# Altium schematic sheet Esquemático.SchDoc
size A4; SheetNumber: 1; SheetTotal: 1
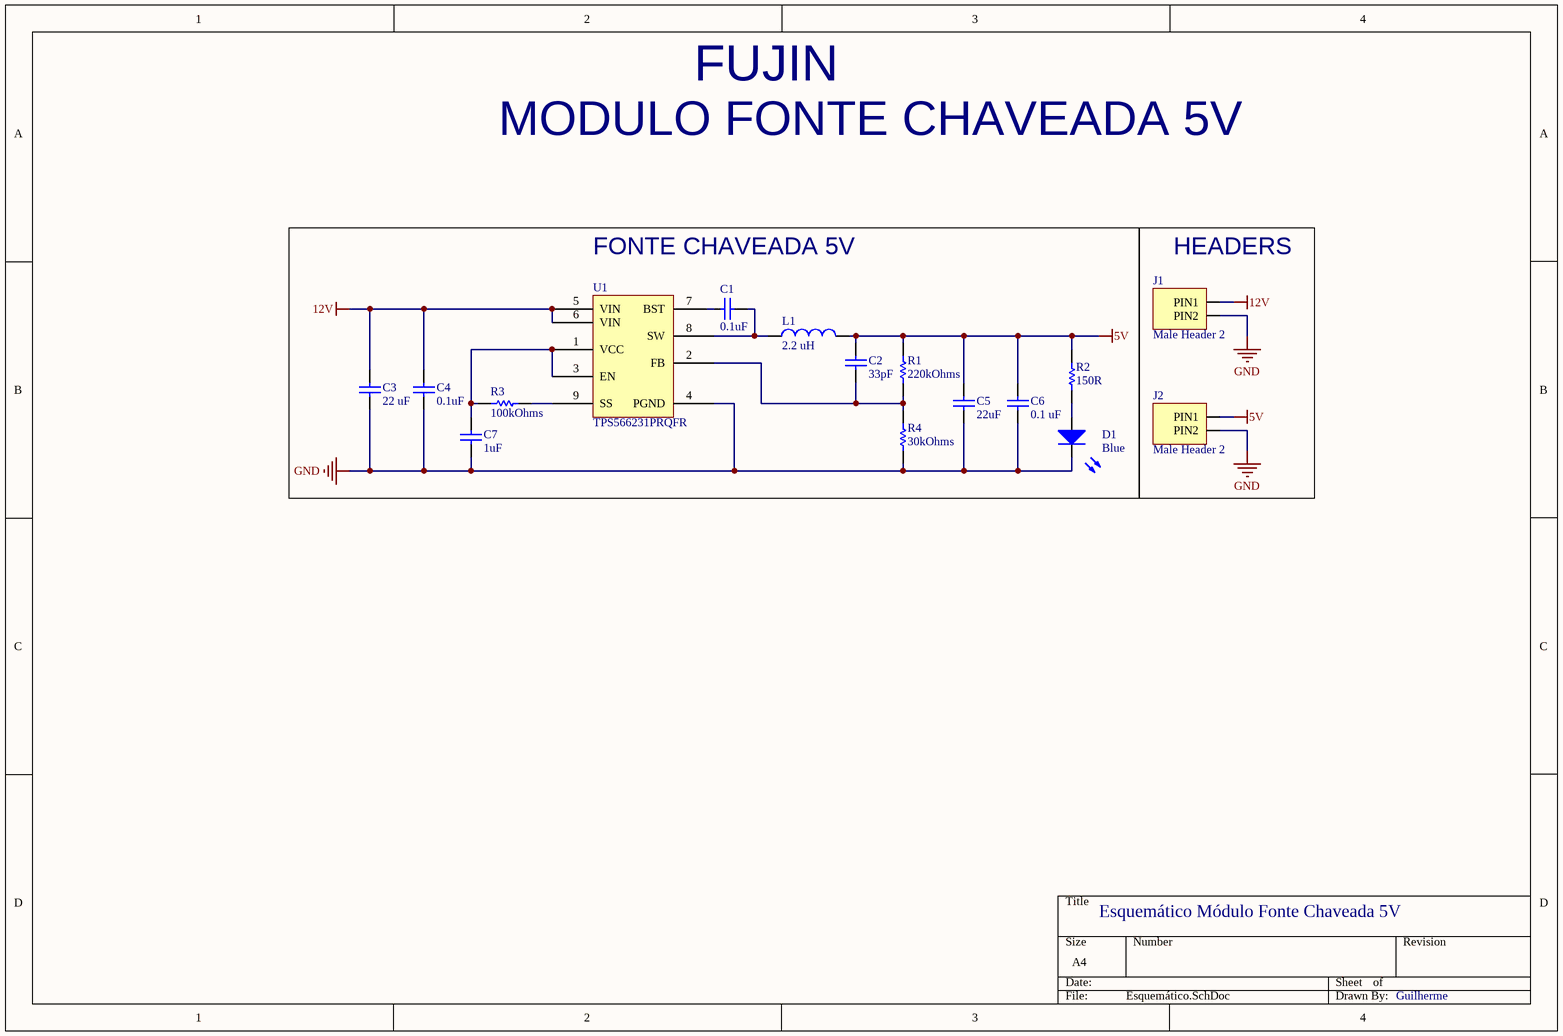
[diagram p0: Esquemático.SchDoc]

## Parts
C1  0.1uF  [CAPC1005X55N]
C2  33pF  [C0201]
C3  22 uF  [C0805]
C4  0.1uF  [CAPC1608X90N]
C5  22uF  [C0805]
C6  0.1 uF  [C0603]
C7  1uF  [C1005]
D1  Blue  [DIODO_2-SMD-3215]
J1  Male Header 2  [MALE HEADER 2]
J2  Male Header 2  [MALE HEADER 2]
L1  2.2 uH  [6045]
R1  220kOhms  [RESISTOR_0603]
R2  150R  [RESISTOR_0402]
R3  100kOhms  [RESC1005X40N]
R4  30kOhms  [RESC1608X55N]
U1  TPS566231PRQFR  [RQF0009A]

## Blocks framed on the sheet
FONTE CHAVEADA 5V: C1-C7 D1 L1 R1-R4 U1
HEADERS: J1 J2

## Nets
5V: C2.2 C5.2 C6.2 J2.PIN1 L1.2 R1.2 R2.2
12V: C3.2 C4.2 J1.PIN1 U1.5(VIN) U1.6(VIN)
GND: C3.1 C4.1 C5.1 C6.1 C7.1 D1.C J1.PIN2 J2.PIN2 R4.1 U1.4(PGND)
NetC1_1: C1.1 L1.1 U1.8(SW)
NetC1_2: C1.2 U1.7(BST)
NetC2_1: C2.1 R1.1 R4.2 U1.2(FB)
NetC7_2: C7.2 R3.1 U1.1(VCC) U1.3(EN)
NetD1_A: D1.A R2.1
NetR3_2: R3.2 U1.9(SS)

## Notes on the sheet
- FUJIN
- MODULO FONTE CHAVEADA 5V
- Esquemático Módulo Fonte Chaveada 5V
- Guilherme

## Library data of the parts
C1 = GRM155R61C104KA88D: CAP CER 0.1uF 16V X5R 0402; Manufacturer: Murata; Tolerance: 10%; Library Control - Checked Footprint: Yes; Library Control - Person that Checked Footprint: Guilherme; Supplier 1: Mouser; Part Number: GRM155R61C104KA88D; Category: Ceramic Capacitors; Price: 1 = 0,10, 10=0,024, 100=0,011 (USD); Supplier Part Number 1: 81-GRM155R61C104KA8D; Library Ref: Capacitor; Operating Temperature: -55°C ~ 85°C; Package / Case: 0402 (1005 Metric); Size / Dimension: 1,0 L x 0,5 W x 0,5 H; Value: 0.1uF; Voltage - Rated: 16V; ESR: -; Dieletric: X5R; Library Control - Checked Schematic: Yes; Library Control - Last Update: 24/07/2021 11:05; Library Control - Person that Checked Schematic: Guilherme; Library Control - Person that did the Last Update Footprint: Guilherme; Library Control - Person that did the Last Update Schematic: Guilherme; ComponentLink1Description: Datasheet; ComponentLink1URL: https://br.mouser.com/datasheet/2/281/1/GRM155R61C104KA88_01A-1983743.pdf; ComponentLink2Description: Mouser Link; ComponentLink2URL: https://br.mouser.com/ProductDetail/Murata-Electronics/GRM155R61C104KA88D?qs=%2Fha2pyFadugsr51Fgcs3VGJIvx6dQb2fpcJyrxDKYTBEoW5q5paGTQ%3D%3D
C2 = CGA1A2C0G1E330J030BA: CAP CER 33pF 25V C0G (NP0) 0201; Manufacturer: TDK; Tolerance: 5%; Library Control - Checked Footprint: Yes; Library Control - Person that Checked Footprint: Guilherme; Library Control - Person that did the Last Update Footprint: Stéfany (Ster); Supplier 1: Mouser; Part Number: CGA1A2C0G1E330J030BA; Category: Ceramic Capacitors; Price: 1 = 0,34, 10=0,082, 100=0,036 (USD); Supplier Part Number 1: 810-CGA1A2C0G1E330J; Library Ref: Capacitor; Operating Temperature: -55°C ~ 125°C; Package / Case: 0201 (0603 Metric); Size / Dimension: 0,6 L x 0,3 W x 0,3 H; Value: 33pF; Voltage - Rated: 25V; ESR: -; Dieletric: C0G (NP0); Library Control - Checked Schematic: Yes; Library Control - Last Update: 06/09/2021 22:37; Library Control - Person that Checked Schematic: Guilherme; Library Control - Person that did the Last Update Schematic: Guilherme; ComponentLink1Description: Datasheet; ComponentLink1URL: https://product.tdk.com/system/files/dam/doc/product/capacitor/ceramic/mlcc/catalog/mlcc_automotive_general_en.pdf; ComponentLink2Description: Mouser Link; ComponentLink2URL: https://br.mouser.com/ProductDetail/TDK/CGA1A2C0G1E330J030BA?qs=%2Fha2pyFadujYI3MxcM4e87jCoYqxM0hkLZT6GI2mHBlvDM1kNVjG3riGd7BUgX8y
C3 = C2012X5R1V226M125AC: CAP CER 22UF 35V X7R 0805; Manufacturer: TDK; Tolerance: 20%; Dieletric: X5R; Library Control - Person that did the Last Update Footprint: Pierre; Supplier 1: Mouser; Part Number: C2012X5R1V226M125AC; Category: Ceramic Capacitor; Price: 1= 0,99, 10= 0,751, 100= 0,537 (USD); Supplier Part Number 1: 810-C2012X5R1V226MAC; Library Ref: Capacitor; Operating Temperature: -55C ~ +85C; Package / Case: 0805 (2012 metric); Size / Dimension: 1.25mm x 2mm x 1.25 mm (HxLxW); Value: 22 uF; Voltage - Rated: 35V; ESR: -; Library Control - Last Update: 11/07/21 - 12:10; Library Control - Person that did the Last Update Schematic: Pierre; ComponentLink1Description: Mouser Link; ComponentLink1URL: https://br.mouser.com/ProductDetail/TDK/C2012X5R1V226M125AC?qs=%2Fha2pyFadujDqt6GaOhNLRdQFkZZGmK3Zr0qXWQTG43%252BZCfduHGyTu2Pm2ksWbbx; ComponentLink2Description: Datasheet; ComponentLink2URL: https://product.tdk.com/system/files/dam/doc/product/capacitor/ceramic/mlcc/catalog/mlcc_commercial_general_en.pdf
C4 = GRM188R72A104KA35D: CAP CER 0.1uF 100V X7R 0603; Manufacturer: Murata; Tolerance: 10%; Library Control - Checked Footprint: Yes; Library Control - Person that Checked Footprint: Guilherme; Supplier 1: Mouser; Part Number: GRM188R72A104KA35D; Category: Ceramic Capacitors; Price: 1 = 0,28, 10=0,121, 100=0,102 (USD); Supplier Part Number 1: 81-GRM188R72A104KA35; Library Ref: Capacitor; Operating Temperature: -55°C ~ 125°C; Package / Case: 0603 (1608 Metric); Size / Dimension: 1,60 L x 0,80 W x 0,80 H; Value: 0.1uF; Voltage - Rated: 100V; ESR: -; Dieletric: X7R; Library Control - Checked Schematic: Yes; Library Control - Last Update: 24/07/2021 11:05; Library Control - Person that Checked Schematic: Guilherme; Library Control - Person that did the Last Update Footprint: Guilherme; Library Control - Person that did the Last Update Schematic: Guilherme; ComponentLink1Description: Datasheet; ComponentLink1URL: https://br.mouser.com/datasheet/2/281/1/GRM188R72A104KA35_01A-1985906.pdf; ComponentLink2Description: Mouser Link; ComponentLink2URL: https://br.mouser.com/ProductDetail/Murata-Electronics/GRM188R72A104KA35D?qs=%2Fha2pyFadujAJDtX6qcn4LVf2TIEcBlj4PhfxwA4tsZBUcArwGh4MA%3D%3D
C5 = LMK212BJ226MG-T: CAP CER 22uF 10V X5R 0805; Manufacturer: Taiyo Yuden; Tolerance: 20%; Library Control - Checked Footprint: Yes; Library Control - Person that Checked Footprint: Guilherme; Library Control - Person that did the Last Update Footprint: Stéfany (Ster); Supplier 1: Mouser; Part Number: LMK212BJ226MG-T; Category: Ceramic Capacitors; Price: 1 = 0,40, 10=0,283, 100=0,17 (USD); Supplier Part Number 1: 963-LMK212BJ226MG-T; Library Ref: Capacitor; Operating Temperature: -55°C ~ 85°C; Package / Case: 0805 (2012 Metric); Size / Dimension: 2,0 L x 1,25 W x 1,25 H; Value: 22uF; Voltage - Rated: 10V; ESR: -; Dieletric: X5R; Library Control - Checked Schematic: Yes; Library Control - Last Update: 06/09/2021 23:23; Library Control - Person that Checked Schematic: Guilherme; Library Control - Person that did the Last Update Schematic: Guilherme; ComponentLink1Description: Datasheet; ComponentLink1URL: https://br.mouser.com/datasheet/2/396/mlcc02_e-1307760.pdf; ComponentLink2Description: Mouser Link; ComponentLink2URL: https://br.mouser.com/ProductDetail/Taiyo-Yuden/LMK212BJ226MG-T?qs=%2Fha2pyFaduhTWJqyA9yCTREf%2Fo8XKOh0QNvJbjdkP7PnwxAMlkivcQ%3D%3D
C6 = GRM188R71E104KA01D: CAP CER 0.1uF 25V X7R 0603; Manufacturer: Murata Electronics; Tolerance: 10%; Voltage - Rated: 25 VDC; ESR: 100 mΩ; Library Control - Checked Footprint: Yes; Library Control - Person that Checked Footprint: Nikaum; Library Control - Person that did the Last Update Footprint: Raquel; Supplier 1: Mouser; Part Number: GRM188R71E104KA01D; Category: Ceramic Capacitors; Price: -; Supplier Part Number 1: 81-GRM39X104K25; Library Ref: Capacitor; Operating Temperature: -55 C ~ 125 C; Package / Case: 0603 (1608 Metric); Size / Dimension: 1,60 L x 0,80 W x 0,80 H; Value: 0.1 uF; Dieletric: X7R; Library Control - Checked Schematic: Yes; Library Control - Last Update: 28/06/2021 00:22; Library Control - Person that Checked Schematic: Nikaum; Library Control - Person that did the Last Update Schematic: Nikaum; ComponentLink1Description: Datasheet; ComponentLink1URL: https://br.mouser.com/datasheet/2/281/murata_03052018_GRM_Series_1-1310166.pdf; ComponentLink2Description: Mouser Link; ComponentLink2URL: https://br.mouser.com/ProductDetail/Murata-Electronics/GRM188R71E104KA01D?qs=%2Fha2pyFaduiZGTXBCPzk%2FmTbMtAE8bS6%252BO3gVgb8hKBi1xePxGtiOg%3D%3D
C7 = C1005X6S1C105K050BC: CAP CER 1uF 16V X6S 0402; Manufacturer: TDK; Tolerance: 10%; Library Control - Checked Footprint: Yes; Library Control - Last Project that Used: Fuijin-MK1; Library Control - Person that Checked Footprint: Guilherme; Supplier 1: Mouser; Part Number: C1005X6S1C105K050BC; Category: Multilayer Ceramic Capacitors MLCC - SMD/SMT; Price: 1=0,13, 10=0.055, 100=0.043 (USD); Supplier Part Number 1: 810-C1005X6S1C105K; Library Ref: Capacitor; Operating Temperature: -55 C ~ 105 C; Package / Case: 0402 (1005 metric); Size / Dimension: 1,00 mm L x 0,50 mm W x 0,5 mm H; Voltage - Rated: 16V; Dieletric: X6S; Library Control - Checked Schematic: Yes; Library Control - Last Update: 17/07/2021 14:33; Library Control - Person that Checked Schematic: Guilherme; Library Control - Person that did the Last Update Footprint: Guilherme; Library Control - Person that did the Last Update Schematic: Guilherme; ComponentLink1Description: Datasheet; ComponentLink1URL: https://product.tdk.com/system/files/dam/doc/product/capacitor/ceramic/mlcc/catalog/mlcc_commercial_general_en.pdf; Value: 1uF; ComponentLink2Description: Mouser Link; ComponentLink2URL: https://br.mouser.com/ProductDetail/TDK/C1005X6S1C105K050BC?qs=%2Fha2pyFaduiE58rMJsOYNOS1N4ksRTL9nFP2OEKa3WnBEcUBb%2FNGJayO9ViIzAba
D1 = EAST3215BA5: LED 75mW BLUE 45MCD 3215; Manufacturer: Everlight Electronics; Current - Forward (If): 20 mA; Voltage - Forward (Vf): 3,30 V; Viewing Angle: 130°; Wavelength: 468 nm; Reverse Voltage: 5 V; Library Control - Checked Footprint: yes; Library Control - Person that Checked Footprint: Lucas; Library Control - Person that did the Last Update Footprint: Stéfany (Ster); Supplier 1: Mouser; Part Number: EAST3215BA5; Category: Standard LEDs - SMD; Price: 1 = 0,3800, 10 = 0,2050, 100 = 0.1080 (USD); Package / Case: 3215; Color: Blue; Operating Temperature: - 40 °C ~ 85 °C; Luminous Intensity: 45 mcd; Library Ref: Diodo/Led; Supplier Part Number 1: 638-EAST3215BA5; Max Power Dissipation: 75 mW; Max Current Rating: 20 mA; Library Control - Checked Schematic: yes; Library Control - Last Update: 13/06/2021 12:45; Library Control - Person that Checked Schematic: Lucas; Library Control - Person that did the Last Update Schematic: Stéfany (Ster); ComponentLink1Description: Mouser Link; ComponentLink1URL: https://www.mouser.com/ProductDetail/Everlight/EAST3215BA5?qs=Cqqh%252BS766wnzp9nQVj5A4g==; ComponentLink2Description: Datasheet; ComponentLink2URL: https://www.mouser.com/datasheet/2/143/EAST3215BA5-1154292.pdf
J1 J2 = Male Header 2: Number of Contacts: 2; Library Control - Person that did the Last Update Schematic: Marcos; System: Connector; Library Ref: Header; Library Control - Checked Footprint: *; Library Control - Checked Schematic: *; Library Control - Last Project that Used: *; Library Control - Last Update: *; Library Control - Person that Checked Footprint: *; Library Control - Person that Checked Schematic: *; Library Control - Persont that did the Last Update Footprint: Marcos
L1 = VLS6045EX-2R2N: IND FIXED 2.2uH 7.5A 0.019OHM; Manufacturer: TDK; DC Resistance (DCR): 0.019; Inductance Frequency - Test: 100kHz; Material - Core: Ferrite; Shielding: Shielded; Tolerance: 30 %; Library Control - Person that did the Last Update Footprint: Marcos; Category: Fixed Inductors; Current Rating (Amps): 7.5A; Frequency - Self Resonant: -; Library Ref: Inductor; Operating Temperature: - 40C ~ 105C; Package / Case: SMD/SMT; Part Number: VLS6045EX-2R2N; Price: 1=0,50, 10=0,346, 100=0,312 1000 = 0,246 (USD); Q @ Freq: -; Size / Dimension: 6 mm x 6 mm x 4.5 mm; Supplier 1: Mouser; Supplier Part Number 1: 810-VLS6045EX-2R2N; Type: Fixed; Value: 2.2 uH; Library Control - Checked Footprint: -; Library Control - Last Project that Used: -; Library Control - Last Update: 10/11/21; Library Control - Person that Checked Footprint: -; Library Control - Person that Checked Schematic: -; Library Control - Person that did the Last Update Schematic: Marcos; ComponentLink1Description: Datasheet; ComponentLink1URL: https://product.tdk.com/system/files/dam/doc/product/inductor/inductor/smd/catalog/inductor_commercial_power_vls6045ex_en.pdf; ComponentLink2Description: Mouser Link; ComponentLink2URL: https://br.mouser.com/ProductDetail/?qs=oF%2FSscNnLpDwTZ5UbvivMw%3D%3D
R1 = RG1608P-224-B-T5: RES SMD 220 kOHMS 0,1% 1/10W 0603; Manufacturer: Susumu; Tolerance: 0,1 %; Temperature Coefficient: 25 PPM / C; Power Rating: 100 mW (1/10 W); Voltage Rating: 100 V; Library Control - Checked Footprint: Yes; Library Control - Person that Checked Footprint: Guilherme; Library Control - Person that did the Last Update Footprint: Stéfany (Ster); Supplier 1: Mouser; Part Number: RG1608P-224-B-T5; Category: Thick Film Resistors - SMD; Price: 1=0,36, 10=0,261, 100=0,107(USD); Package / Case: 0603 (1608 Metric); Operating Temperature: - 55°C ~ 155°C; Value: 220kOhms; Library Ref: Resistor; Resistor Type: Fixo; Size / Dimension: 1,6 L x 0,8 W x 0,4 H; Supplier Part Number 1: 754-RG1608P-224-BT5; Library Control - Checked Schematic: Yes; Library Control - Last Update: 06/09/2021 23:26; Library Control - Person that Checked Schematic: Guilherme; Library Control - Person that did the Last Update Schematic: Guilherme; ComponentLink1Description: Mouser Link; ComponentLink1URL: https://br.mouser.com/ProductDetail/Susumu/RG1608P-224-B-T5?qs=%2Fha2pyFadugGZ8qiVjKZw3%2FyFcS5dmvF9YguiNF8xC%252BJU8zG6Xddcw%3D%3D; ComponentLink2Description: Datasheet; ComponentLink2URL: https://br.mouser.com/datasheet/2/392/n_catalog_partition01_en-1140338.pdf
R2 = CRCW0100150RFREL: RES SMD 150 OHM 1% 1/32W 0402; Manufacturer: Vishay; Temperature Coefficient: 250 PPM / C; Power Rating: 30 mW (1/32 W); Voltage Rating: 15 V; Library Control - Checked Footprint: Yes; Library Control - Person that Checked Footprint: Guilherme; Supplier 1: Mouser; Part Number: CRCW0100150RFREL; Category: Thick Film Resistors - SMD; Price: 1=0,19, 10=0,084, 100=0,062 (USD); Package / Case: 71-CRCW0100150RFREL; Operating Temperature: - 55ºC ~ 125ºC; Value: 150R; Tolerance: 1 %; Library Ref: Resistor; Resistor Type: Fixed; Size / Dimension: 0.4 mm L x  0.2 mm W x  0.13 mm H; Supplier Part Number 1: 71-CRCW0100150RFREL; Library Control - Checked Schematic: Yes; Library Control - Last Update: 14/09/2021 14:39; Library Control - Person that Checked Schematic: Guilherme; Library Control - Person that did the Last Update Footprint: Guilherme; Library Control - Person that did the Last Update Schematic: Guilherme; ComponentLink1Description: Mouser Link; ComponentLink1URL: https://br.mouser.com/ProductDetail/Vishay-Dale/CRCW0100150RFREL?qs=sGAEpiMZZMtlubZbdhIBIMHZ5gvv1VGt%2FDJwZ3JI3CA%3D; ComponentLink2Description: Datasheet; ComponentLink2URL: https://br.mouser.com/datasheet/2/427/VISH_S_A0011831033_1-2572231.pdf
R3 = CRCW0402100KFKED: RES SMD 100 kOHMS 1% 1/16W 0402; Manufacturer: Vishay; Temperature Coefficient: 100 PPM / C; Power Rating: 62,5 mW (1/16 W); Voltage Rating: 50 V; Library Control - Checked Footprint: Yes; Library Control - Person that Checked Footprint: Guilherme; Supplier 1: Mouser; Part Number: CRCW0402100KFKED; Category: Thick Film Resistors - SMD; Price: 1=0,11, 10=0,04, 100=0,016(USD); Package / Case: 0402 (1005 Metric); Operating Temperature: - 55°C ~ 155°C; Value: 100kOhms; Tolerance: 1 %; Library Ref: Resistor; Resistor Type: Fixo; Size / Dimension: 1,0 L x 0,5 W x 0,35 H; Supplier Part Number 1: 71-CRCW0402-100K-E3; Library Control - Checked Schematic: Yes; Library Control - Last Update: 24/07/2021 11:34; Library Control - Person that Checked Schematic: Guilherme; Library Control - Person that did the Last Update Footprint: Guilherme; Library Control - Person that did the Last Update Schematic: Guilherme; ComponentLink1Description: Mouser Link; ComponentLink1URL: https://br.mouser.com/ProductDetail/Vishay-Dale/CRCW0402100KFKED?qs=OlqPY1CiralZGKRwQ4Glcg%3D%3D; ComponentLink2Description: Datasheet; ComponentLink2URL: https://br.mouser.com/datasheet/2/427/dcrcwe3-1762152.pdf
R4 = RC0603FR-0730KL: RES SMD 30 kOHMS 1% 1/10W 0603; Manufacturer: YAGEO; Temperature Coefficient: 100 PPM / C; Power Rating: 100 mW (1/10 W); Voltage Rating: 50 V; Library Control - Checked Footprint: Yes; Library Control - Person that Checked Footprint: Guilherme; Supplier 1: Mouser; Part Number: RC0603FR-0730KL; Category: Thick Film Resistors - SMD; Price: 1=0,10, 10=0,024, 100=0,01(USD); Package / Case: 0603 (1608 Metric); Operating Temperature: - 55°C ~ 155°C; Value: 30kOhms; Tolerance: 1 %; Library Ref: Resistor; Resistor Type: Fixo; Size / Dimension: 1,6 L x 0,8 W x 0,45 H; Supplier Part Number 1: 603-RC0603FR-0730KL; Library Control - Checked Schematic: Yes; Library Control - Last Update: 24/07/2021 11:34; Library Control - Person that Checked Schematic: Guilherme; Library Control - Person that did the Last Update Footprint: Guilherme; Library Control - Person that did the Last Update Schematic: Guilherme; ComponentLink1Description: Mouser Link; ComponentLink1URL: https://br.mouser.com/ProductDetail/YAGEO/RC0603FR-0730KL?qs=diQw95jMAeNFr44yr782FQ%3D%3D; ComponentLink2Description: Datasheet; ComponentLink2URL: https://br.mouser.com/datasheet/2/447/Yageo_03_18_2021_PYu_RC_Group_51_RoHS_L_11-2199992.pdf
U1 = TPS566231PRQFR: IC REG SWITCHING 4A 0,6V TO 7V; Manufacturer: Texas Instruments; Output Type: Regulated; Number of Regulators: 1; Voltage - Input (Max): 18V; Voltage - Output (Min/Fixed): 600mV; Library Control - Checked Footprint: Yes; Library Control - Person that Checked Footprint: Guilherme; Library Control - Person that did the Last Update Footprint: Marques; Voltage - Input (Min): 4.5V; Current - Output: 6A; Frequency - Switching: 600kHz; Current - Operating Supply: 75uA; Supplier 1: MOUSER; Part Number: TPS566231PRQFR; Library Ref: Voltage Regulator; Category: Switching Voltage Regulator; Price: 1=2,92, 10=2,63, 100=2,15 (USD); Package/ Case: VQFN-HR; Operating Temperature: -40°C ~ 125ºC; Max Power Dissipation: -; Supplier Part Number 1: 595-TPS566231PRQFR; Voltage - Dropout (Max): -; Library Control - Checked Schematic: Yes; Library Control - Last Update: 24/07/21; Library Control - Person that Checked Schematic: Guilherme; Library Control - Person that did the Last Update Schematic: Marques; Voltage - Output (Max): 7V; ComponentLink1Description: Datasheet; ComponentLink1URL: https://www.ti.com/lit/ds/symlink/tps566231.pdf?ts=1627121525087; ComponentLink2Description: Mouser Link; ComponentLink2URL: https://br.mouser.com/ProductDetail/Texas-Instruments/TPS566231PRQFR?qs=%2Fha2pyFaduin4%252BaGmPtS5cEip%2FV5xNoRI9ELwGck3HsUjgtKYNm%2FDQ%3D%3D